# EAGLE design hub (EAGLE 8.4.3)
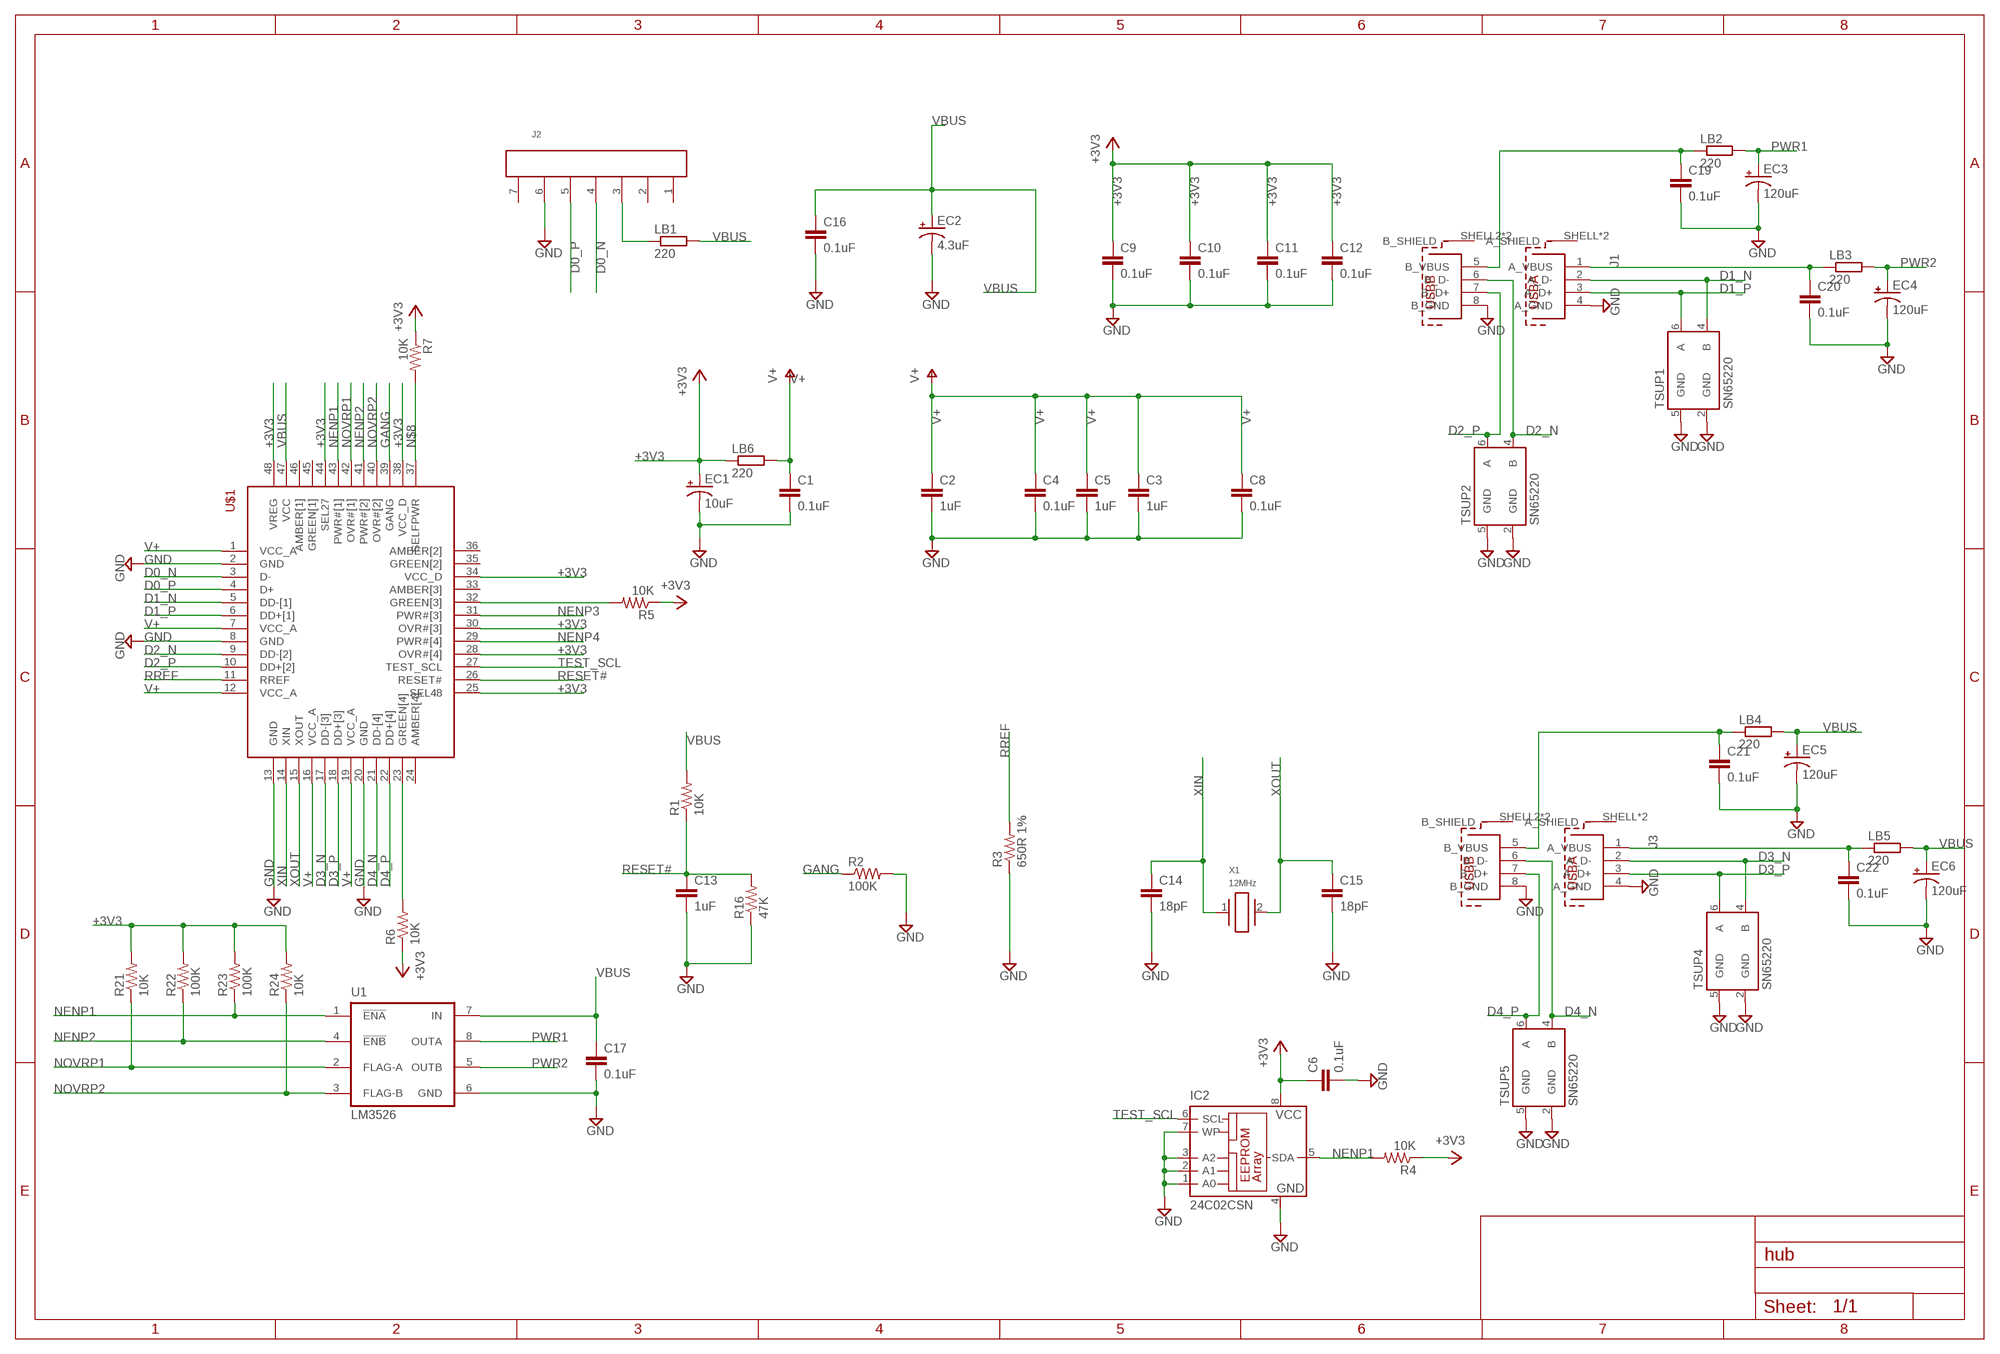
[diagram p0: schematic, sheet 1]

## Parts
C1  0.1uF  C-EUC0805  [C0805]
C2  1uF  C-EUC0805  [C0805]
C3  1uF  C-EUC0805  [C0805]
C4  0.1uF  C-EUC0805  [C0805]
C5  1uF  C-EUC0805  [C0805]
C6  0.1uF  C-EUC0805  [C0805]
C8  0.1uF  C-EUC0805  [C0805]
C9  0.1uF  C-EUC0805  [C0805]
C10  0.1uF  C-EUC0805  [C0805]
C11  0.1uF  C-EUC0805  [C0805]
C12  0.1uF  C-EUC0805  [C0805]
C13  1uF  C-EUC0805  [C0805]
C14  18pF  C-EUC0805  [C0805]
C15  18pF  C-EUC0805  [C0805]
C16  0.1uF  C-EUC0805  [C0805]
C17  0.1uF  C-EUC0805  [C0805]
C19  0.1uF  C-EUC0805  [C0805]
C20  0.1uF  C-EUC0805  [C0805]
C21  0.1uF  C-EUC0805  [C0805]
C22  0.1uF  C-EUC0805  [C0805]
EC1  10uF  100UF-POLAR-RADIAL-2.5MM-25V-20%  [CPOL-RADIAL-2.5MM-6.5MM]
EC2  4.3uF  CPOL-USUD-5X5,8  [UD-5X5,8_NICHICON]
EC3  120uF  100UF-POLAR-RADIAL-2.5MM-25V-20%  [CPOL-RADIAL-2.5MM-6.5MM]
EC4  120uF  100UF-POLAR-RADIAL-2.5MM-25V-20%  [CPOL-RADIAL-2.5MM-6.5MM]
EC5  120uF  100UF-POLAR-RADIAL-2.5MM-25V-20%  [CPOL-RADIAL-2.5MM-6.5MM]
EC6  120uF  100UF-POLAR-RADIAL-2.5MM-25V-20%  [CPOL-RADIAL-2.5MM-6.5MM]
IC2  24C02CSN  [SO-08]
J1  61400826021  [61400826021]
J2  62000711622  [62000711622]
J3  61400826021  [61400826021]
LB1  220  R-EU_R0805  [R0805]
LB2  220  R-EU_R0805  [R0805]
LB3  220  R-EU_R0805  [R0805]
LB4  220  R-EU_R0805  [R0805]
LB5  220  R-EU_R0805  [R0805]
LB6  220  R-EU_R0805  [R0805]
R1  10K  R-US_M0805  [M0805]
R2  100K  R-US_M0805  [M0805]
R3  650R 1%  R-US_M0805  [M0805]
R4  10K  R-US_M0805  [M0805]
R5  10K  R-US_M0805  [M0805]
R6  10K  R-US_M0805  [M0805]
R7  10K  R-US_M0805  [M0805]
R16  47K  R-US_M0805  [M0805]
R21  10K  R-US_M0805  [M0805]
R22  100K  R-US_M0805  [M0805]
R23  100K  R-US_M0805  [M0805]
R24  10K  R-US_M0805  [M0805]
TSUP1  SN65220  SN65220DBV  [SOT23-6]
TSUP2  SN65220  SN65220DBV  [SOT23-6]
TSUP4  SN65220  SN65220DBV  [SOT23-6]
TSUP5  SN65220  SN65220DBV  [SOT23-6]
U1  LM3526  LM3526-L  [SO08]
U$1  CY7C65632  CY7C65634-48AXCT  [TQFP48_7X7]
X1  12MHz  ABLS-12.000MHZ-B2-T  [XTAL_ABLS2-24.000MHZ-D4YF-T]

## Nets
+3V3: C6.1 C9.1 C10.1 C11.1 C12.1 EC1.1(+) IC2.8(VCC) LB6.1 R4.1 R5.1 R6.1 R7.1 R21.2 R22.2 R23.2 R24.2 U$1.25(SEL48) U$1.28(OVR#[4]) U$1.30(OVR#[3]) U$1.34(VCC_D) U$1.38(VCC_D) U$1.44(SEL27) U$1.48(VREG)
D0_N [USB]: J2.4 U$1.3(D-)
D0_P [USB]: J2.5 U$1.4(D+)
D1_N [USB]: J1.2(A_D-) TSUP1.4(B) U$1.5(DD-[1])
D1_P [USB]: J1.3(A_D+) TSUP1.6(A) U$1.6(DD+[1])
D2_N [USB]: J1.6(B_D-) TSUP2.4(B) U$1.9(DD-[2])
D2_P [USB]: J1.7(B_D+) TSUP2.6(A) U$1.10(DD+[2])
D3_N [USB]: J3.2(A_D-) TSUP4.4(B) U$1.17(DD-[3])
D3_P [USB]: J3.3(A_D+) TSUP4.6(A) U$1.18(DD+[3])
D4_N [USB]: J3.6(B_D-) TSUP5.4(B) U$1.21(DD-[4])
D4_P [USB]: J3.7(B_D+) TSUP5.6(A) U$1.22(DD+[4])
GANG: R2.1 U$1.39(GANG)
GND: C1.2 C2.2 C3.2 C4.2 C5.2 C6.2 C8.2 C9.2 C10.2 C11.2 C12.2 C13.2 C14.2 C15.2 C16.2 C17.2 C19.2 C20.2 C21.2 C22.2 EC1.2(-) EC2.- EC3.2(-) EC4.2(-) EC5.2(-) EC6.2(-) IC2.1(A0) IC2.2(A1) IC2.3(A2) IC2.4(GND) IC2.7(WP) J1.4(A_GND) J1.8(B_GND) J2.6 J3.4(A_GND) J3.8(B_GND) R2.2 R3.1 R16.1 TSUP1.2(GND) TSUP1.5(GND) TSUP2.2(GND) TSUP2.5(GND) TSUP4.2(GND) TSUP4.5(GND) TSUP5.2(GND) TSUP5.5(GND) U1.6(GND) U$1.2(GND) U$1.8(GND) U$1.13(GND) U$1.20(GND)
N$1: C19.1 J1.5(B_VBUS) LB2.1
N$2: C21.1 J3.5(B_VBUS) LB4.1
N$3: C22.1 J3.1(A_VBUS) LB5.1
N$4: C20.1 J1.1(A_VBUS) LB3.1
N$5: J2.3 LB1.1
N$6: R6.2 U$1.23(GREEN[4])
N$7: R5.2 U$1.32(GREEN[3])
N$8: R7.2 U$1.37(SELFPWR)
NENP1: IC2.5(SDA) R4.2 R23.1 U1.1(!ENA!) U$1.43(PWR#[1])
NENP2: R22.1 U1.4(!ENB!) U$1.41(PWR#[2])
NENP3: U$1.31(PWR#[3])
NENP4: U$1.29(PWR#[4])
NOVRP1: R21.1 U1.2(FLAG-A) U$1.42(OVR#[1])
NOVRP2: R24.1 U1.3(FLAG-B) U$1.40(OVR#[2])
PWR1: EC3.1(+) LB2.2 U1.8(OUTA)
PWR2: EC4.1(+) LB3.2 U1.5(OUTB)
RESET#: C13.1 R1.1 R16.2 U$1.26(RESET#)
RREF: R3.2 U$1.11(RREF)
TEST_SCL: IC2.6(SCL) U$1.27(TEST_SCL)
V+: C1.1 C2.1 C3.1 C4.1 C5.1 C8.1 LB6.2 U$1.1(VCC_A) U$1.7(VCC_A) U$1.12(VCC_A) U$1.16(VCC_A) U$1.19(VCC_A)
VBUS: C16.1 C17.1 EC2.+ EC5.1(+) EC6.1(+) LB1.2 LB4.2 LB5.2 R1.2 U1.7(IN) U$1.47(VCC)
XIN: C14.1 U$1.14(XIN) X1.1
XOUT: C15.1 U$1.15(XOUT) X1.2
Unconnected: J1.SHELL1(A_SHIELD) J1.SHELL2(B_SHIELD) J1.SHELL3(B_SHIELD) J1.SHELL(A_SHIELD) J2.1 J2.2 J2.7 J3.SHELL1(A_SHIELD) J3.SHELL2(B_SHIELD) J3.SHELL3(B_SHIELD) J3.SHELL(A_SHIELD) U$1.24(AMBER[4]) U$1.33(AMBER[3]) U$1.35(GREEN[2]) U$1.36(AMBER[2]) U$1.45(GREEN[1]) U$1.46(AMBER[1])

## Library data of the parts
C1 C4 C6 C8-C12 C16 C17 C19-C22 = rcl:C-EU: CAPACITOR, European symbol; DIGIKEY: 732-8026-1-ND; MPN: GRM21BR71H104KA01L; OC_MOUSER: 81-GRM40X104K50L
C2 C3 C5 C13 = rcl:C-EU: CAPACITOR, European symbol; DIGIKEY: 399-1284-1-ND; MPN: C0805C105K4RACTU; OC_MOUSER: 80-C0805C105K4R
C14 C15 = rcl:C-EU: CAPACITOR, European symbol; DIGIKEY: 1276-1107-1-ND; MPN: CL21C180JBANNNC; OC_MOUSER: 77-VJ0805A180GXACBC
EC1 = SparkFun-Capacitors:100UF-POLAR: 100µF polarized capacitors A capacitor is a passive two-terminal electrical component used to store electrical energy temporarily in an electric field.; DIGIKEY: 493-16013-1-ND; MF: nichicon; MPN: UST1H100MDD1TE; OC_MOUSER: 647-UST1H100MDD1TE; PROD_ID: CAP-08439; VALUE: 100uF
EC2 = rcl:CPOL-US: POLARIZED CAPACITOR, American symbol; DIGIKEY: 338-3973-1-ND; MPN: UUP1C4R7MCL1GS; OC_MOUSER: 647-UUP1C4R7MCL1GS
EC3-EC6 = SparkFun-Capacitors:100UF-POLAR: 100µF polarized capacitors A capacitor is a passive two-terminal electrical component used to store electrical energy temporarily in an electric field.; DIGIKEY: 565-1791-ND; MPN: ELXY250ELL121MF15D; OC_MOUSER: 661-ELXY250ELL121MF1; PROD_ID: CAP-08439; VALUE: 100uF
IC2 = microchip:24C*: Serial EEPROM 1 K/2 K/4 K; DIGIKEY: 24C02C/SN-ND; MF: MICROCHIP; MPN: 24C02C/SN; OC_FARNELL: 1607552; OC_NEWARK: 96K4065
J1 J3 = InputOutputIO (rev17e):61400826021: WR-COM Horizontal Dual Stacked USB Type A=>Code : Con_I-O_COM_USB-2.0_A_61400826021 <http://katalog.we-online.de/media/images/eican/Con_I-O_COM_USB-2.0_A_61400826021_pf2.jpg> Details see: http://katalog.we-online.de/en/em/614_008_260_21 Created 2014-07-09, Karrer Zheng 2014 (C) Würth Elektronik; DIGIKEY: 732-2107-ND; MPN: 61400826021; OC_MOUSER: 710-61400826021
J2 = Wire-to-Board (rev17c):62000711622: WR-WTB 2.00mm Male Vertical Shrouded Header, 7 Pins=>Code : Con_WTB_2.00_PCB_THT_62000711622 <http://katalog.we-online.de/media/thumbs2/eican/thb_Con_WTB_2.00_PCB_THT_6200xx11622_pf2.jpg> Details see: http://katalog.we-online.de/en/em/WTB_2_00_MALE_VERTICAL_SHROUDED_HEADER_6200XX11622 Created 2014-06-05, Karrer Zheng 2014 (C) Würth Elektronik; DIGIKEY: A100039-ND; MF: te; MPN: 440054-7; OC_MOUSER: 571-440054-7
LB1-LB6 = rcl:R-EU_: RESISTOR, European symbol; DIGIKEY: 490-1054-1-ND; MPN: BLM21PG221SN1D; OC_MOUSER: 81-BLM21P221SG
R1 R4-R7 R21 R24 = rcl:R-US_: RESISTOR, American symbol; DIGIKEY: 311-10.0KCRCT-ND; MPN: RC0805FR-0710KL; OC_MOUSER: 603-RC0805FR-0710KL
R2 R22 R23 = rcl:R-US_: RESISTOR, American symbol; DIGIKEY: 311-100KCRCT-ND; MPN: RC0805FR-07100KL; OC_MOUSER: 603-RC0805FR-07100KL
R3 = rcl:R-US_: RESISTOR, American symbol; DIGIKEY: 311-649CRCT-ND; MPN: RC0805FR-07649RL; OC_MOUSER: 603-RC0805FR-07649RL
R16 = rcl:R-US_: RESISTOR, American symbol; DIGIKEY: 311-47.0KCRCT-ND; MPN: RC0805FR-0747KL; OC_MOUSER: 603-RC0805FR-0747KL
TSUP1 TSUP2 TSUP4 TSUP5 = sn65220_40:SN65220: USB Port Transient Suppressor; DIGIKEY: 296-9694-1-ND; MPN: SN65220DBVR; OC_MOUSER: 595-SN65220DBVR
U1 = national-semi:LM3526-L: Dual Port USB Power Switch with over-current protection; DIGIKEY: LM3526MX-L/NOPBCT-ND; MPN: LM3526MX-L/NOPB; OC_MOUSER: 926-LM3526MX-L/NOPB
U$1 = CY7C65634-48AXCT:CY7C65634-48AXCT; DIGIKEY: 428-3155-1-ND; MPN: CY7C65632-48AXCT; OC_MOUSER: 727-CY7C65632-48AXCT
X1 = ABLS-12.000MHZ-B2-T:ABLS-12.000MHZ-B2-T: None; AVAILABILITY: Good; DESCRIPTION: CRYSTAL 12.0000MHZ 18PF SMD; DIGIKEY: 535-9067-1-ND; MF: Abracon LLC; MP: ABLS-12.000MHZ-B2-T; MPN: ABLS-12.000MHZ-B2-T; OC_MOUSER: 815-ABLS-12-B2; PACKAGE: HC49/US Abracon; PRICE: 0.20 USD

## Net classes
1 USB: width 0.35 mm, clearance 0.5 mm
2 power: width 0.4 mm

## Board
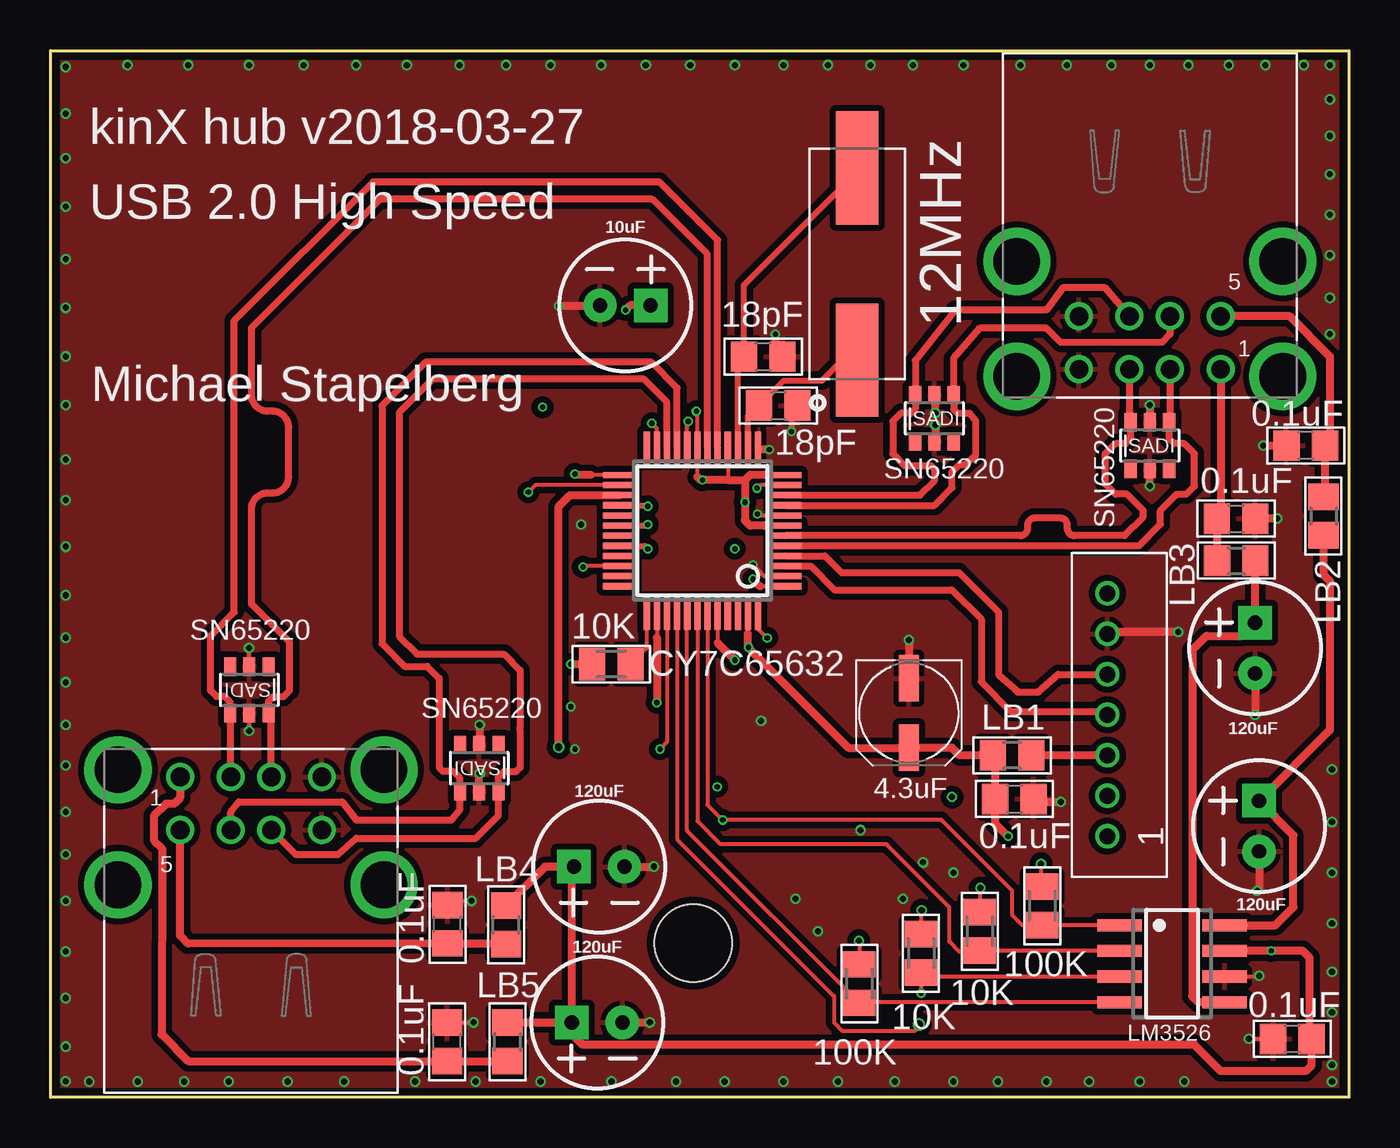
[diagram p1: board, top side]
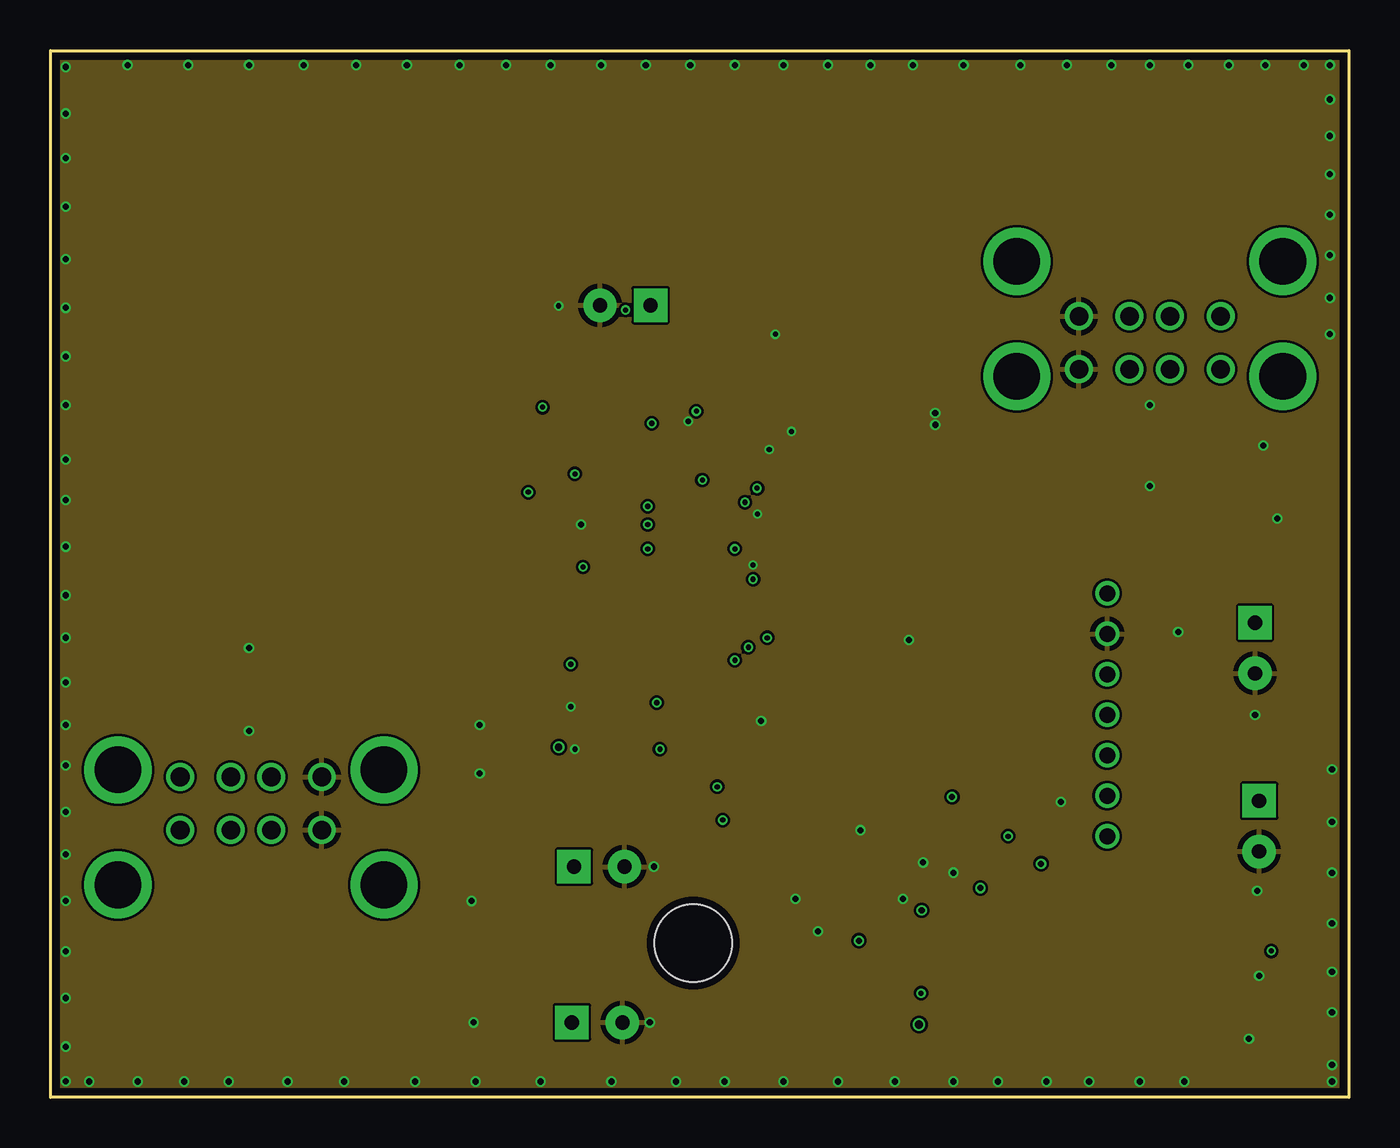
[diagram p2: board, inner layer Route2]
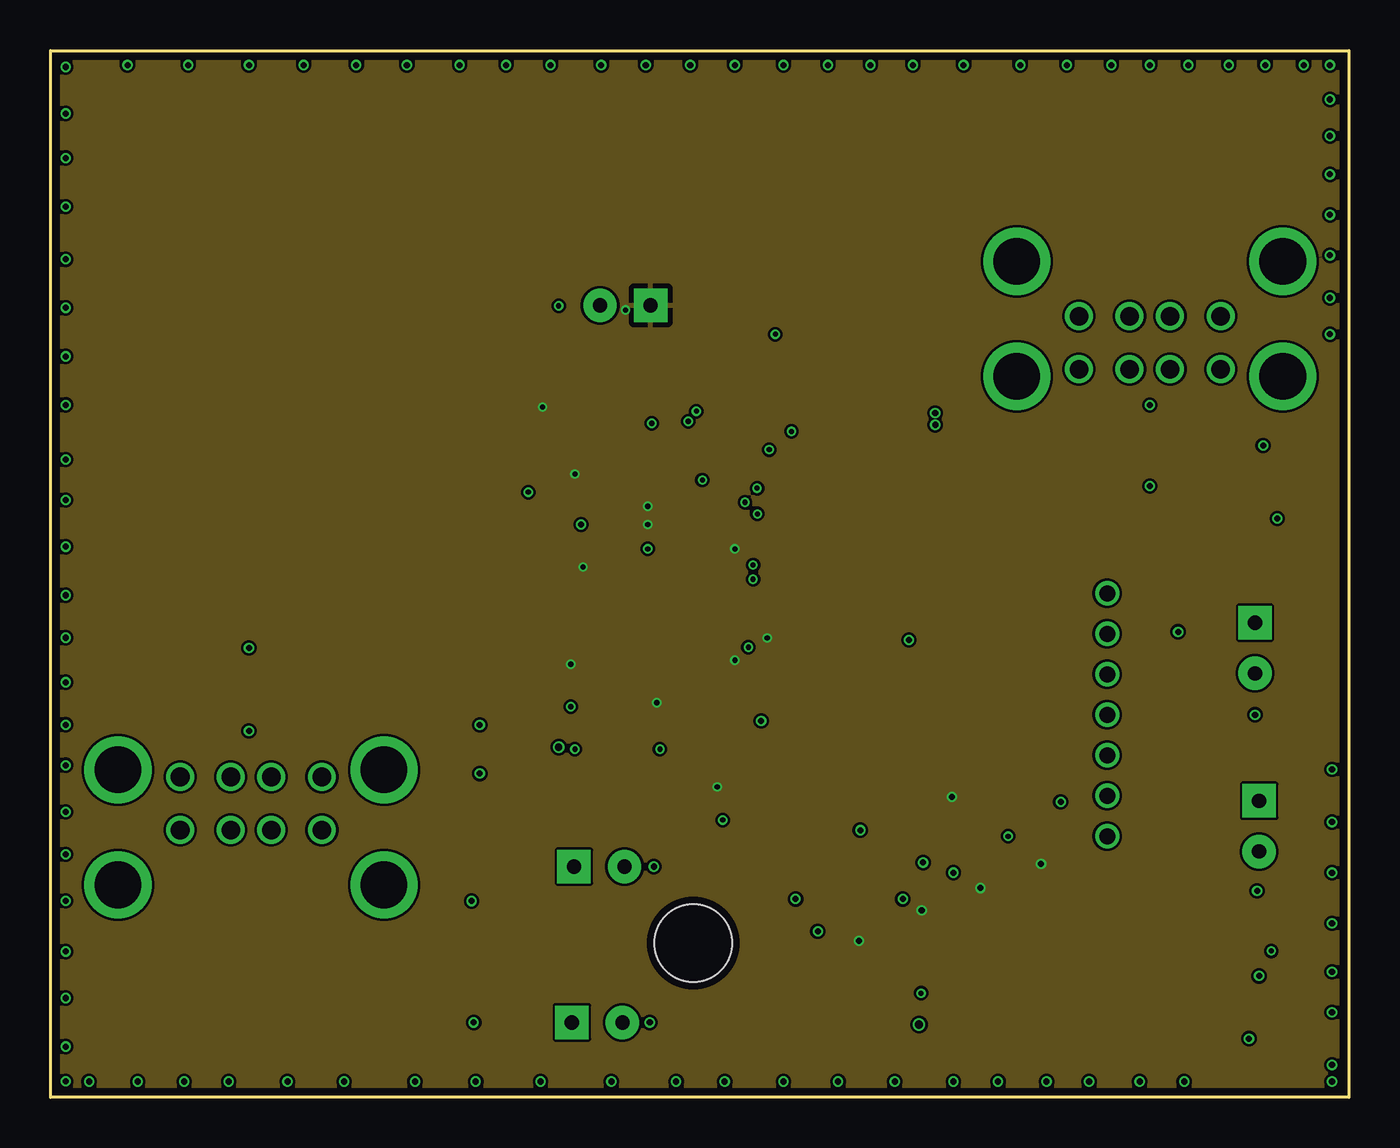
[diagram p3: board, inner layer Route15]
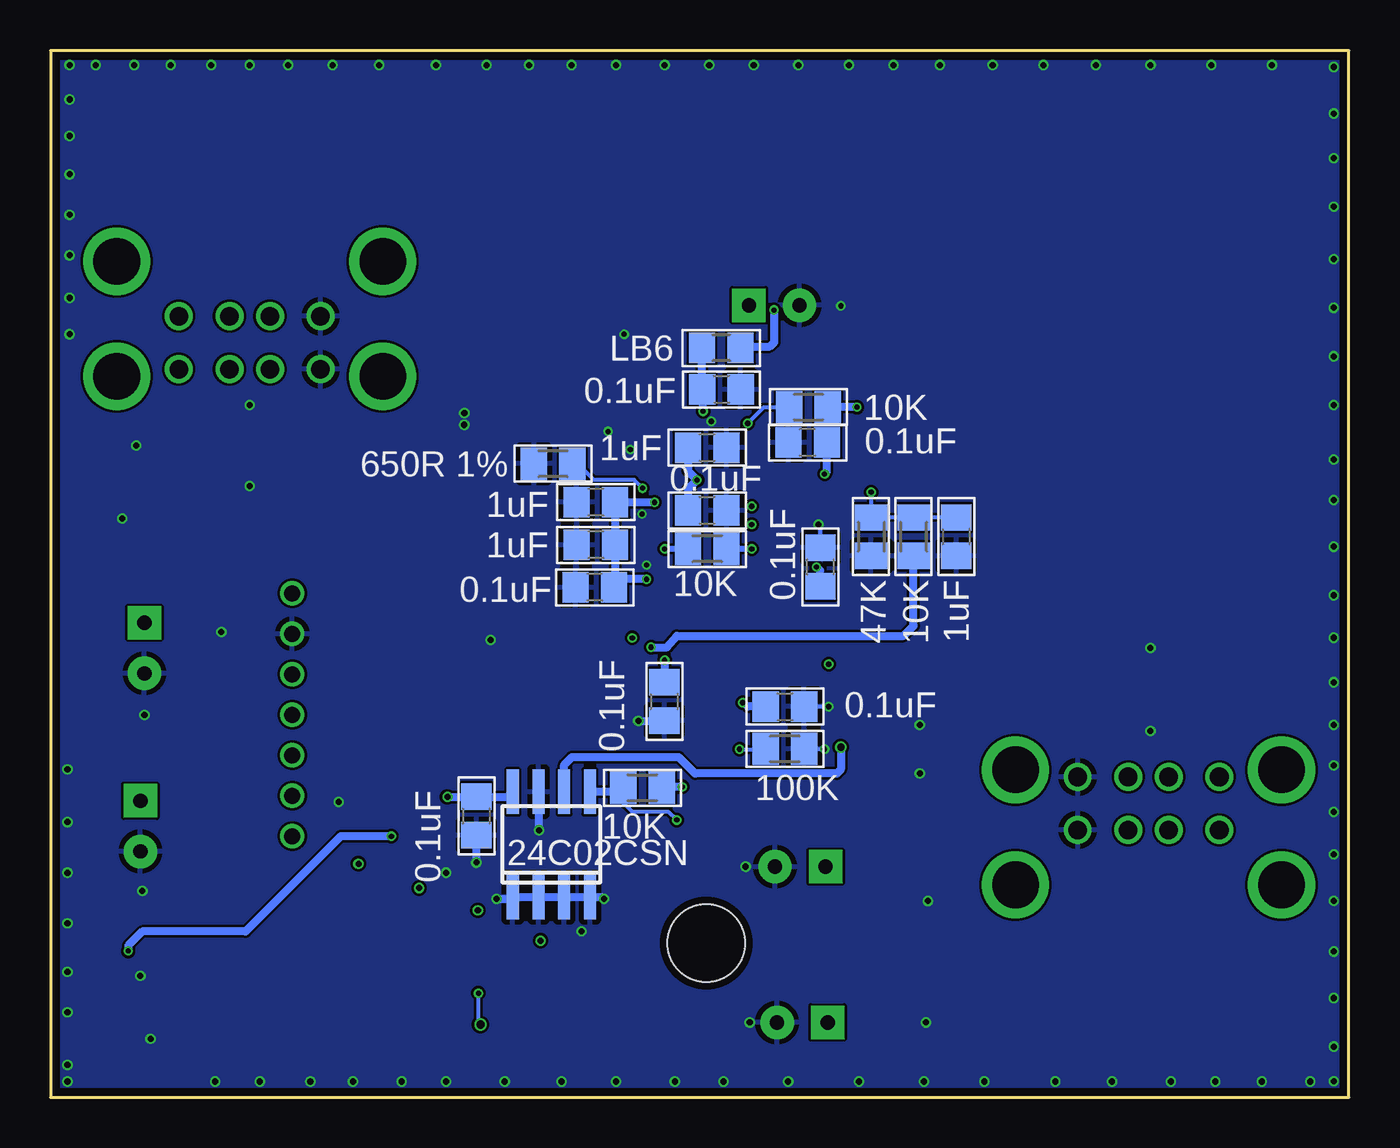
[diagram p4: board, bottom side, seen from below]

Size 64.14 x 51.71 mm. Coordinates in mm from the lower left corner, seen from the top.
Outline: 0,0 0,51.71 64.14,51.71 64.14,0 0,0
Copper layers (1*2*15*16): Top 0.035559375mm / dielectric 0.17018125mm / Route2 0.01778125mm / dielectric 47mil / Route15 0.01778125mm / dielectric 0.17018125mm / Bottom 0.035559375mm
Design rules "oshpark-4layer": minimum track width 5mil, minimum drill 10mil, track to track 5mil, track to pad 5mil, pad to pad 5mil, via to via 5mil, smd to smd 5mil, copper to edge 15mil, drill to drill 6mil, minimum pad ring 4mil, minimum via ring 4mil, stop-mask expansion 2.5mil, vias tented up to drill 0mil, thermal gap 10mil
Holes 3.81 mm at 31.75,7.62

### Footprints (pad centres in the part's own frame; a part is rotated, then mirrored left to right if it is on the bottom)
C0805 = smd 1.3 x 1.5: 1 -0.95,0; 2 0.95,0
CPOL-RADIAL-2.5MM-6.5MM = drill 0.7 pad 1.651 square: 1 1.25,0 | drill 0.7 pad 1.651: 2 -1.25,0
UD-5X5,8_NICHICON = smd 2.3 x 1: + 1.725,0; - -1.7,0
SO-08 = smd 0.6 x 2.2: 1 -1.905,-2.6; 2 -0.635,-2.6; 3 0.635,-2.6; 4 1.905,-2.6; 5 1.905,2.6; 6 0.635,2.6; 7 -0.635,2.6; 8 -1.905,2.6
61400826021 = drill 0.92: 1 -3.5,5.33; 2 -1,5.33; 3 1,5.33; 4 3.5,5.33; 5 -3.5,2.71; 6 -1,2.71; 7 1,2.71; 8 3.5,2.71 | drill 2.3: SHELL -6.57,5.68; SHELL1 6.57,5.68; SHELL2 6.57,0; SHELL3 -6.57,0
62000711622 = drill 0.8: 1 6,0; 2 4,0; 3 2,0; 4 0,0; 5 -2,0; 6 -4,0; 7 -6,0
R0805 = smd 1.3 x 1.5: 1 -0.95,0; 2 0.95,0
M0805 = smd 1.3 x 1.6: 1 -0.95,0; 2 0.95,0
SOT23-6 = smd 0.6 x 0.9: 1 -0.95,-1.15; 2 0,-1.15; 3 0.95,-1.15; 4 0.95,1.15; 5 0,1.15; 6 -0.95,1.15
SO08 = smd 0.6 x 2.2: 1 -1.905,-2.6; 2 -0.635,-2.6; 3 0.635,-2.6; 4 1.905,-2.6; 5 1.905,2.6; 6 0.635,2.6; 7 -0.635,2.6; 8 -1.905,2.6
TQFP48_7X7 = smd 0.3 x 1.6: 1 -2.75,-4.1; 2 -2.25,-4.1; 3 -1.75,-4.1; 4 -1.25,-4.1; 5 -0.75,-4.1; 6 -0.25,-4.1; 7 0.25,-4.1; 8 0.75,-4.1; 9 1.25,-4.1; 10 1.75,-4.1; 11 2.25,-4.1; 12 2.75,-4.1; 25 2.75,4.1; 26 2.25,4.1; 27 1.75,4.1; 28 1.25,4.1; 29 0.75,4.1; 30 0.25,4.1; 31 -0.25,4.1; 32 -0.75,4.1; 33 -1.25,4.1; 34 -1.75,4.1; 35 -2.25,4.1; 36 -2.75,4.1 | smd 1.6 x 0.3: 13 4.1,-2.75; 14 4.1,-2.25; 15 4.1,-1.75; 16 4.1,-1.25; 17 4.1,-0.75; 18 4.1,-0.25; 19 4.1,0.25; 20 4.1,0.75; 21 4.1,1.25; 22 4.1,1.75; 23 4.1,2.25; 24 4.1,2.75; 37 -4.1,2.75; 38 -4.1,2.25; 39 -4.1,1.75; 40 -4.1,1.25; 41 -4.1,0.75; 42 -4.1,0.25; 43 -4.1,-0.25; 44 -4.1,-0.75; 45 -4.1,-1.25; 46 -4.1,-1.75; 47 -4.1,-2.25; 48 -4.1,-2.75
XTAL_ABLS2-24.000MHZ-D4YF-T = smd 5.6 x 2.1: 1 -4.75,0; 2 4.75,0

### Placement (x,y rotation side)
C1  31,34.98 0 bottom
C2  31.7,32.1 0 bottom
C3  37.2,27.3 180 bottom
C4  37.25,25.2 180 bottom
C5  37.2,29.4 180 bottom
C6  43.1,13.9 270 bottom
C8  31.7,29 0 bottom
C9  26.74,32.35 180 bottom
C10  26.1,26.21 90 bottom
C11  33.82,19.56 270 bottom
C12  27.86,19.3 0 bottom
C13  19.4,27.7 270 bottom
C14  35.94,34.18 0 top
C15  35.2,36.6 0 top
C16  47.61,14.74 0 top
C17  61.34,2.89 180 top
C19  62,32.2 180 top
C20  58.56,28.59 0 top
C21  19.6,8.56 90 top
C22  19.59,2.74 90 top
EC1  28.39,39.13 0 top
EC2  42.4,19 270 top
EC3  59.7,13.4 90 top
EC4  59.5,22.2 90 top
EC5  27.1,11.4 180 top
EC6  27,3.7 180 top
IC2  39.4,12.5 0 bottom
J1  54.3,41.3 180 top
J2  52.2,18.9 270 top
J3  9.9,10.5 0 top
LB1  47.5,16.9 180 top
LB2  62.88,28.72 270 top
LB3  58.56,26.51 0 top
LB4  22.5,8.53 90 top
LB5  22.57,2.74 90 top
LB6  31.01,37.03 180 bottom
R1  21.5,27.7 270 bottom
R2  27.86,17.22 0 bottom
R3  39.31,31.31 0 bottom
R4  34.9,15.3 180 bottom
R5  31.7,27.1 0 bottom
R6  26.7,34.1 180 bottom
R7  27.7,21.4 0 top
R16  23.6,27.7 90 bottom
R21  45.9,8.2 90 top
R22  39.95,5.62 90 top
R23  48.99,9.46 90 top
R24  43,7.12 90 top
TSUP1  54.3,32.2 0 top
TSUP2  43.66,33.55 0 top
TSUP4  9.82,20.13 180 top
TSUP5  21.17,16.26 180 top
U1  55.4,6.6 270 top
U$1  32.2,28 90 top
X1  39.85,41.17 90 top

### Tracks (layer width: path | path; a pad name or v marks a point on that pad's centre or on a via)
+3V3  (via drill 0.25, 0.3)
  Top 0.2: U$1.25 26.69,30.75 | 25.95,30.75 v25.9,30.8 | U$1.38 29.95,22.7 | v39.93,7.74 39.95,7.72 R22.2 | v43.03,9.24 43,9.21 R24.2 | v45.93,10.34 45.9,10.31 R21.2 | v48.93,11.54 48.93,10.46 R23.2 | U$1.44 32.95,22.45 | U$1.48 34.95,23.15 v35.4,22.7 | U$1.34 26.35,26.25 v26.3,26.2
  Top 0.3: U$1.28 29.45,29.25 v29.5,29.2 | U$1.30 29.45,28.25 v29.5,28.3
  Top 0.4: 26.69,30.75 25.95,30.75 | 32.95,22.45 v33.8,21.6 | EC1.1 28.63,39.13 v28.4,38.9 | v25.7,21.4 R7.1 | v29.94,19.5 v29.95,19.5 29.95,22.7
  Bottom 0.2: C12.1 | 33.8,20.53 C11.1 | 26.11,26.01 C10.1
  Bottom 0.3: R5.1 v33.8,27.1
  Bottom 0.4: v25.9,30.8 25.79,30.91 C9.1 | v33.8,21.6 33.8,20.53 | v26.3,26.2 26.11,26.01 | v28.4,38.9 28.4,37.3 28.6,37.1 29.98,37.1 LB6.1 | v24.3,34.1 R6.1 | IC2.8 41.55,14.85 C6.1 v44.53,14.84 | v32.93,15.34 33.91,15.34 R4.1 | C12.1 29.7,19.3 v29.94,19.5
  pour Route15: 0,51.7 0,0 3.3,0 64.1,0 64.1,2.4 64.1,51.7
D0_N
  Top 0.35: U$1.3 37.55,26.25 38.72,25.07 44.52,25.07 45.98,23.62 45.98,20.52 47.42,19.07 52.02,19.07 J2.4
D0_P
  Top 0.35: U$1.4 38.25,26.75 39.08,25.93 44.88,25.93 46.83,23.98 46.83,20.88 47.78,20.02 48.8,20.02 49.77,20.9 J2.5
D1_N
  Top 0.35: J1.2 55.3,33.4 TSUP1.4 55.25,32.55 55.5,32.3 56,32.3 56.5,31.8 56.5,30.2 56.1,29.8 55.62,29.8 54.83,29 54.83,28.32 53.75,27.25 U$1.5
D1_P
  Top 0.35: J1.3 53.3,33.4 TSUP1.6 53.35,32.55 53.1,32.3 52.6,32.3 52.1,31.8 52.1,30.3 52.6,29.8 53.17,29.8 53.98,29 53.98,28.68 53.05,27.75 50.59,27.75 arc-90 50.23,28.11 50.23,28.26 arc90 49.86,28.62 48.62,28.62 arc90 48.26,28.26 48.26,28.11 arc-90 47.9,27.75 U$1.6
D2_N
  Top 0.35: J1.6 55.3,37.7 54.9,37.3 49.9,37.3 49.2,38 45.9,38 44.6,36.5 TSUP2.4 44.61,33.99 44.8,33.8 45.4,33.8 45.7,33.4 45.7,31.72 45.19,31.27 44.9,31.27 44.52,30.9 44.52,30.12 43.65,29.25 U$1.9
D2_P
  Top 0.35: J1.7 52.09,40 50,40 49.2,38.9 44.7,38.9 42.71,36.41 TSUP2.6 42.71,34.01 42.5,33.8 42,33.8 41.6,33.4 41.6,31.8 42.2,31.2 43.5,31.2 43.67,31.02 43.67,30.48 42.95,29.75 U$1.10
D3_N
  Top 0.35: J3.2 8.9,18.94 TSUP4.4 8.87,19.53 8.6,19.8 8.2,19.8 7.9,20.1 7.9,22.8 9.07,23.98 9.07,38.38 15.92,45.23 30.08,45.23 32.95,42.35 U$1.17
D3_P
  Top 0.35: J3.3 10.9,18.84 TSUP4.6 10.77,19.57 11,19.8 11.5,19.8 11.8,20.1 11.8,22.5 9.93,24.38 9.93,29.06 arc-90 10.72,29.86 10.96,29.86 arc90 11.76,30.66 11.76,33.1 arc90 10.96,33.9 10.72,33.9 arc-90 9.93,34.7 9.93,38.02 16.28,44.38 29.72,44.38 32.45,41.65 U$1.18
D4_N
  Top 0.35: U$1.21 30.95,35.05 29.68,36.33 18.52,36.33 16.38,34.18 16.38,22.42 17.5,21.3 18.6,21.3 19.2,20.7 19.2,16.3 19.4,16.1 19.9,16.1 20.22,15.78 TSUP5.4 20.22,14.22 19.8,13.7 15.1,13.7 14.4,14.6 9.3,14.6 8.9,14.1 J3.6
D4_P
  Top 0.35: U$1.22 30.45,34.35 29.32,35.48 18.88,35.48 17.23,33.82 17.23,22.78 18.1,21.9 22.4,21.9 23.2,21.1 23.2,18.3 23.2,18.1 23.2,16.3 23,16.1 22.4,16.1 22.12,15.82 TSUP5.6 22.12,13.92 21,12.8 15.1,12.8 14.2,12 12.11,12 J3.7
GANG  (via drill 0.25)
  Top 0.2: U$1.39 30.45,17.55 v30.1,17.2
  Bottom 0.2: v30.1,17.2 28.83,17.2 R2.1
GND  (via drill 0.25, 0.3)
  Top 0.2: C22.2 v20.9,3.7 | 21.2,17.44 TSUP5.2 | v20.8,9.7 19.79,9.7 C21.2 | v59.7,6 59.66,5.96 U1.6 | v59.2,2.9 59.21,2.89 C17.2 | TSUP4.2 9.8,21.29 v9.8,22.2 | TSUP4.5 9.8,18.96 v9.8,18.1 | U$1.20 31.45,33.35 v31.5,33.4 | U$1.2 35.25,25.75 v34.7,26.3 | v34.92,28.82 34.99,28.75 35.4,28.75 | 35.63,28.75 35.7,28.75
  Top 0.3: C14.2 36.6,33.89 v36.6,32.9 | 35.4,28.75 35.63,28.75 U$1.8
  Top 0.4: v21.2,18.4 21.2,17.44 | v42.4,22.6 EC2.- | v59.9,32.2 C19.2 | v54.3,34.2 TSUP1.5 | v54.3,30.2 TSUP1.2 | v55.7,23 52.3,23 J2.6 | C16.2 48.7,14.6 v49.9,14.6 | EC1.2 26.66,39.1 v25.1,39.1 | v35.5,32 35.05,32 U$1.13 | C15.2 35.8,36.95 v35.8,37.7 | EC5.2 v29.8,11.4 | EC6.2 v29.6,3.7 | EC4.2 v59.5,18.9 | EC3.2 59.7,10.3 v59.6,10.2 | v43.7,33.8 43.7,34.66 TSUP2.5 | v43.7,33.23 43.7,32.44 TSUP2.2 | v60.6,28.6 C20.2 | TSUP5.5 21.17,15.97 v21.2,16
  Bottom 0.2: v25.7,19.3 C12.2 | v25.9,17.2 26.9,17.2 R2.2 | C10.2 26.11,28.21 v26.2,28.3
  Bottom 0.4: v35.1,18.6 33.83,18.6 C11.2 | v43.1,11.6 C6.2 | v42.1,9.8 41.41,9.8 IC2.1 IC2.2 IC2.3 IC2.4 36.9,9.9 v36.8,9.8 | v40,13.2 40,15.06 IC2.7
  other vias: 37.9,8.2 44.6,11.1 0.74,50.91 3.8,51 6.8,51 9.8,51 12.5,51 15.1,51 17.6,51 20.2,51 22.5,51 24.7,51 27.2,51 29.4,51 31.6,51 33.8,51 36.2,51 38.4,51 40.5,51 42.6,51 45.1,51 0.74,48.61 0.74,46.41 0.74,44.01 0.74,41.41 0.74,39.01 0.74,36.61 0.74,34.21 0.74,31.51 0.74,29.51 0.74,27.21 0.74,24.81 0.74,22.71 0.74,20.51 0.74,18.41 0.74,16.41 0.74,14.11 0.74,12.01 0.74,9.71 0.74,7.21 0.74,4.91 0.74,2.51 47.9,51 50.2,51 52.4,51 54.3,51 56.2,51 58.2,51 60,51 61.9,51 63.2,51 63.2,49.3 63.2,47.5 63.2,45.6 63.2,43.6 63.2,41.6 63.2,39.5 63.2,37.7 63.3,16.2 63.3,13.6 63.3,11.1 63.3,8.6 63.3,6.2 63.3,4.2 63.3,1.6 63.3,0.78 56,0.78 53.8,0.78 51.3,0.78 49.2,0.78 46.8,0.78 44.6,0.78 41.7,0.78 38.9,0.78 36.2,0.78 33.3,0.78 30.9,0.78 27.7,0.78 24.2,0.78 21,0.78 18,0.78 14.5,0.78 11.7,0.78 8.8,0.78 6.6,0.78 4.3,0.78 1.9,0.78 0.74,0.79
  pour Top (isolate 0.305): 0,51.82 0,0 1.52,0 64.01,0 64.01,3.3 64.01,51.82
  pour Route2: 0,51.82 0,0 1.78,0 64.26,0 64.26,2.29 64.26,51.82 60.2,51.82
  pour Bottom: 0,51.7 0,0 2,0 64.1,0 64.1,11.6 64.1,51.7 55.2,51.7
N$1
  Top 0.2: 63.2,32.45 C19.1
  Top 0.4: J1.5 61.21,38.59 63.2,36.6 63.2,32.45 | C19.1 62.95,29.74 LB2.1
N$2
  Top 0.2: 22.49,7.59 LB4.1 | 19.63,7.58 C21.1
  Top 0.4: J3.5 6.4,8 6.81,7.59 C21.1 | LB4.1 19.63,7.58
N$3
  Top 0.4: LB5.1 C22.1 6.81,1.79 5.49,3.12 5.5,12.3 5.1,12.7 5.1,13.9 5.7,14.5 6.1,14.5 6.4,14.8 J3.1
N$4
  Top 0.2: LB3.1
  Top 0.4: LB3.1 C20.1 57.8,28.78 J1.1
N$5
  Top 0.4: J2.3 LB1.1
N$6  (via drill 0.25)
  Top 0.2: U$1.23 29.95,33.05 v29.7,33.3
  Bottom 0.2: v29.7,33.3 28.9,34.1 R6.2
N$7  (via drill 0.25)
  Top 0.3: U$1.32 29.35,27.25 v29.5,27.1
  Bottom 0.3: v29.5,27.1 R5.2
N$8
  Top 0.2: U$1.37 29.45,22.2 R7.2
NENP1  (via drill 0.25)
  Top 0.2: U1.1 R23.1 48.98,8.5 48,8.5 47.5,9 47.5,10.2 44,13.7 v33.2,13.7 32.45,14.45 U$1.43
  Bottom 0.2: v33.2,13.7 33.6,14.1 35.4,14.1 35.98,14.68 35.98,15.18
  Bottom 0.4: R4.2 35.98,15.18 36.05,15.1 IC2.5
NENP2
  Top 0.2: U1.4 39.97,4.7 R22.1 31.45,13.17 U$1.41
NOVRP1
  Top 0.2: U1.2 45.91,7.24 R21.1 45.85,7.2 44.9,7.2 44.4,7.7 44.4,9.4 41.3,12.5 33.1,12.5 31.95,13.65 U$1.42
NOVRP2  (via drill 0.25, 0.4)
  Top 0.2: R24.1 | U$1.40 30.95,12.75 38.7,5 38.7,3.7 39.1,3.3 42.7,3.3 42.9,3.5 v42.9,3.6 | v43,5.14 43.01,5.15 R24.1 | U1.3 43.21,5.96 R24.1
  Bottom 0.2: v42.9,3.6 43,3.7 v43,5.14
PWR1
  Top 0.4: U1.8 60.51,8.51 61.4,9.4 61.4,12.95 EC3.1 63.2,18.15 63.2,25.5 62.88,25.82 LB2.2
PWR2
  Top 0.2: 58.1,4.7 U1.5
  Top 0.4: U1.5 56.7,4.7 56.4,5 56.4,22.1 57.1,22.8 58.85,22.8 EC4.1 59.52,23.46 LB3.2
RESET#  (via drill 0.25)
  Top 0.2: U$1.26 23.95,30.25 v23.6,29.9
  Bottom 0.2: v23.6,29.9 R16.2 R1.1 C13.1
RREF  (via drill 0.25)
  Top 0.2: U$1.11 35.05,30.25 v34.9,30.09
  Bottom 0.2: v34.9,30.09 35.3,30.5 37.3,30.5 38.11,31.31 R3.2
TEST_SCL  (via drill 0.35)
  Top 0.4: v25.1,17.3 25.1,29.2 25.65,29.75 U$1.27
  Bottom 0.4: IC2.6 38.77,16.43 38.4,16.8 33.1,16.8 32.3,16 25.3,16 25.1,16.2 v25.1,17.3
V+  (via drill 0.25)
  Top 0.2: U$1.7 35.29,28.25 | U$1.12 35.3,30.75 35.29,30.75 | 31.95,30.65 U$1.19 31.95,33.85 v31.9,33.9 | v32.2,30.5 32.1,30.5 | U$1.16 33.47,30.5 | U$1.1 35.05,25.25
  Top 0.4: 35.29,28.25 34.55,28.25 34.3,28.5 v34.3,29.4 34.3,30.5 | 35.29,30.75 34.55,30.75 34.3,30.5 | 31.95,30.65 32.1,30.5 | v32.2,30.5 33.47,30.5 34.3,30.5 | 35.05,25.25 v34.7,25.6
  Bottom 0.2: C4.1 36.25,25.6 | LB6.2 31.95,36.72 | 31.9,34.93 C1.1
  Bottom 0.4: v34.3,29.4 C5.1 C3.1 36.25,25.25 C4.1 | C8.1 32.65,30.05 v32.2,30.5 32.65,30.95 C2.1 | v34.7,25.6 36.25,25.6 | C1.1 31.95,36.72 | v31.9,33.9 31.9,34.93
VBUS  (via drill 0.25)
  Top 0.2: 34.45,22.23 34.44,22.24 | 34.44,22.91 U$1.47 | C17.1 62.2,2.98
  Top 0.4: 34.44,22.24 34.44,22.91 | LB1.2 46.66,16.79 C16.1 46.66,13.54 v47.3,12.9 | LB1.2 46.17,17.27 | LB1.2 44.9,16.9 44.52,17.27 EC2.+ 39.42,17.27 37.4,19.3 34.45,22.23 34.48,22.23 v34.47,22.24 | C17.1 62.29,1.59 62,1.3 57.8,1.3 56.5,2.6 26.27,2.6 25.75,3.12 EC6.1 | 62.2,2.98 62.2,6.9 61.87,7.24 v60.3,7.24 U1.7 | LB4.2 24.42,11.4 EC5.1 25.75,11.3 EC6.1 | LB5.2 EC6.1
  Bottom 0.4: v34.47,22.24 33.68,22.24 33.2,22.8 22,22.8 21.5,23.3 R1.2 | v47.3,12.9 49.8,12.9 54.5,8.2 59.6,8.2 60.3,7.5 v60.3,7.24
XIN
  Top 0.3: U$1.14 34.45,33.64 C14.1 36.21,35.4 38.1,35.4 39.12,36.42 X1.1
XOUT
  Top 0.3: U$1.15 33.95,36.3 C15.1 34.25,40.13 39.85,45.72 X1.2

### Text on the board
tNames: kinX hub v2018-03-27 | USB 2.0 High Speed | Michael Stapelberg